# Altium project Business.PrjPcb
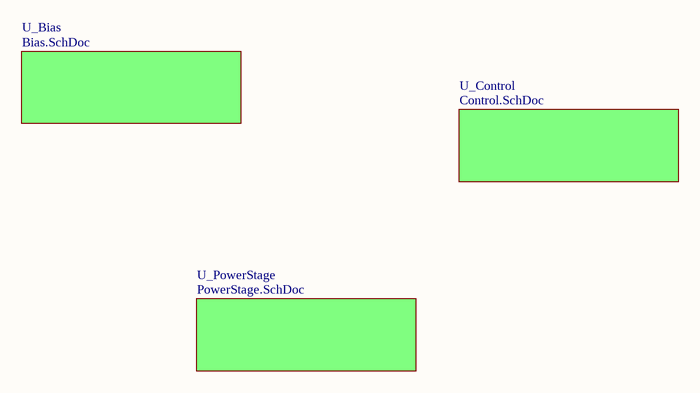
[diagram p0: Master.SchDoc]
3 sheets, 25 parts. Net scope: flat (ports and power ports of the same name join across sheets).
Board file: USB.PcbDoc
Sheets:
  Master.SchDoc
  MSC.SchDoc
  Lighting.SchDoc

## Sheet Master.SchDoc
size A; SheetNumber: 1; SheetTotal: 4

### Sub-sheets
U_Bias = Bias.SchDoc (file not in this document): no entries
U_Control = Control.SchDoc (file not in this document): no entries
U_PowerStage = PowerStage.SchDoc (file not in this document): no entries

## Sheet MSC.SchDoc: MSC
size A4; Revision: Rev A; SheetNumber: 2; SheetTotal: 3
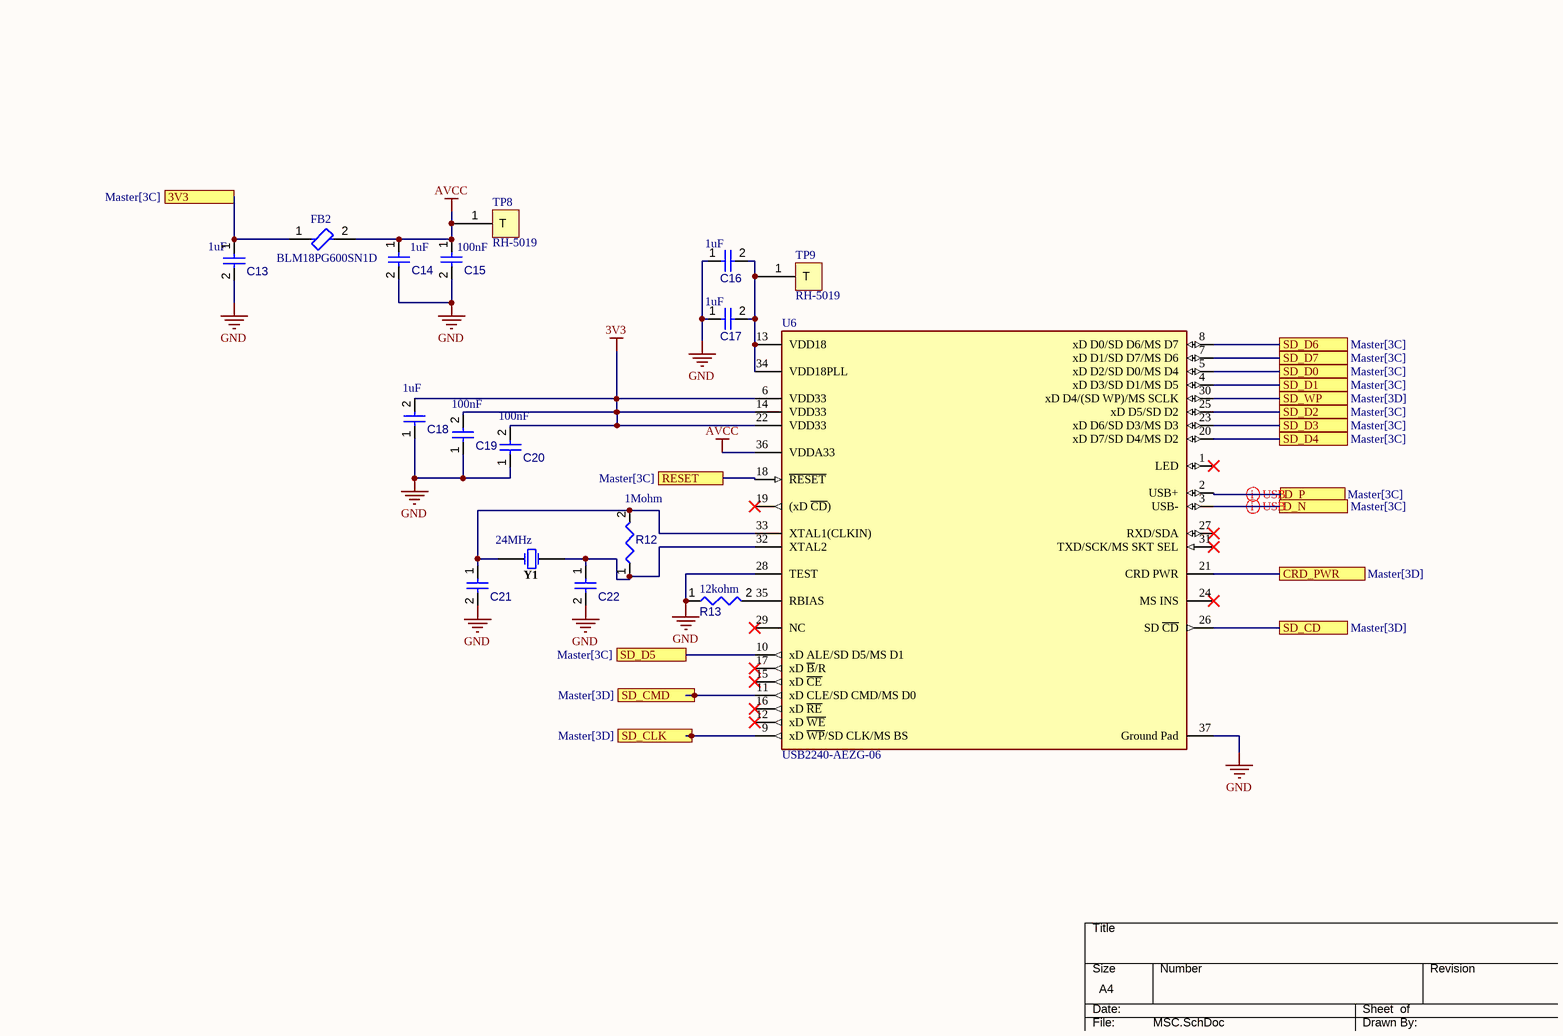
[diagram p1: MSC.SchDoc]

### Parts
C13  value 1uF  (hidden comment: Capacitors)
C14  value 1uF  (hidden comment: Capacitors,10uF)
C15  value 100nF  (hidden comment: Capacitors,100nF)
C16  value 1uF  (hidden comment: Capacitors,1uF)
C17  value 1uF  (hidden comment: Capacitors,1uF)
C18  value 1uF  (hidden comment: Capacitors,1uF)
C19  value 100nF  (hidden comment: Capacitors,0.1u)
C20  value 100nF  (hidden comment: Capacitors)
C21  Capacitors  (value not drawn)
C22  Capacitors  (value not drawn)
FB2  BLM18PG600SN1D  [FP-BLM18-0_15-t0_8-IPC_B]
R12  value 1Mohm  (hidden comment: Resistors)
R13  value 12kohm  (hidden comment: Resistors)
TP8  RH-5019  [RH-5019-Footprint-1]
TP9  RH-5019  [RH-5019-Footprint-1]
U6  USB2240-AEZG-06  [FP-36QFN-4106-6x6B-MFG]
Y1  Frequency: 24MHz  (hidden comment: Crystals & Oscillators,24MHz)

### Ports
3V3 (see Master[3C]), CRD_PWR (see Master[3D]), D_N (see Master[3C]), D_P (see Master[3C]), RESET (see Master[3C]), SD_CD (see Master[3D]), SD_CLK (see Master[3D]), SD_CMD (see Master[3D]), SD_D0 (see Master[3C]), SD_D1 (see Master[3C]), SD_D2 (see Master[3C]), SD_D3 (see Master[3C]), SD_D4 (see Master[3C]), SD_D5 (see Master[3C]), SD_D6 (see Master[3C]), SD_D7 (see Master[3C]), SD_WP (see Master[3D])

### Nets
3V3: C18.2 C19.2 C20.2 U6.6(VDD33) U6.14(VDD33) U6.22(VDD33)
AVCC: C14.1 C15.1 FB2.2 TP8.1(T) U6.36(VDDA33)
GND: C13.2 C14.2 C15.2 C16.1 C17.1 C18.1 C19.1 C20.1 C21.2 C22.2 R13.1 U6.28(TEST) U6.37(Ground_Pad)
NetC13_1: C13.1 FB2.1 ; port 3V3
NetC16_2: C16.2 C17.2 TP9.1(T) U6.13(VDD18) U6.34(VDD18PLL)
NetC21_1: C21.1 R12.2 U6.33(XTAL1(CLKIN)) Y1.2
NetC22_1: C22.1 R12.1 U6.32(XTAL2) Y1.1
NetR13_2: R13.2 U6.35(RBIAS)
NetU6_2: U6.2(USB+) ; port D_P
NetU6_3: U6.3(USB-) ; port D_N
NetU6_4: U6.4(xD_D3/SD_D1/MS_D5) ; port SD_D1
NetU6_5: U6.5(xD_D2/SD_D0/MS_D4) ; port SD_D0
NetU6_7: U6.7(xD_D1/SD_D7/MS_D6) ; port SD_D7
NetU6_8: U6.8(xD_D0/SD_D6/MS_D7) ; port SD_D6
NetU6_9: U6.9(xD_~{WP}/SD_CLK/MS_BS) ; port SD_CLK
NetU6_10: U6.10(xD_ALE/SD_D5/MS_D1) ; port SD_D5
NetU6_11: U6.11(xD_CLE/SD_CMD/MS_D0) ; port SD_CMD
NetU6_18: U6.18(~{RESET}) ; port RESET
NetU6_20: U6.20(xD_D7/SD_D4/MS_D2) ; port SD_D4
NetU6_21: U6.21(CRD_PWR) ; port CRD_PWR
NetU6_23: U6.23(xD_D6/SD_D3/MS_D3) ; port SD_D3
NetU6_25: U6.25(xD_D5/SD_D2) ; port SD_D2
NetU6_26: U6.26(SD_~{CD}) ; port SD_CD
NetU6_30: U6.30(xD_D4/(SD_WP)/MS_SCLK) ; port SD_WP

Not connected (* = marked no-connect by the designer): U6 1(LED)* 12(xD_~{WE})* 15(xD_~{CE})* 16(xD_~{RE})* 17(xD_~{B}/R)* 19((xD_~{CD}))* 24(MS_INS)* 27(RXD/SDA)* 29(NC)* 31(TXD/SCK/MS_SKT_SEL)*

### Layout directives
differential pair: NetU6_2, NetU6_3

### Notes on the sheet
- THIS DOCUMENT AND THE DATA DISCLOSED HEREIN OR
- HEREWITH IS THE PROPERTY OF ALTIUM LIMITED AND MAY
- DWG NO:
- REVISION
- REV:
- DESCRIPTION
- DATE
- APPROVED
- BE FREELY DISTRIBUTED IN WHOLE. NO RIGHTS ARE
- RESERVED OR EXPRESS OR IMPLIED WARANTEE GIVEN.
- ENG:
- APPROVALS
- PROJECT
- DSN:
- CHK:
- REFERENCE DOCUMENTS
- PROJECT REVISION:
- TITLE
- DOCUMENT REVISION:
- DESIGN ITEM:
- BOM:
- FAB DWG:
- PCB DWG:
- ASSY DWG:
- SCALE:
- A3
- SIZE
- CAGE CODE
- FILE NAME
- DWG NO.
- SHEET
- OF
- REV

### Library data of the parts
C13-C22 = Capacitors: Capacitor; Component Type: Capacitors
FB2 = CMP-0686-00575-3: Chip Ferrite Bead, 0603, 60Ω @ 100MHz, 0.1Ω, , 1A; ESR (Equivalent Series Resistance): 60R; Number of Lines: 1; Material: Steel; Tolerance: 25%; Shielding: Unshielded; Current Rating: 500mA; Resistance: 100mR; Package Quantity: 1; Termination: SMD/SMT; Lead Free: Lead Free; Max Operating Temperature: 125°C; Number of Circuits: 1; Length: 1.6mm; Min Operating Temperature: -55°C; Case Code (Metric): 1608; Max DC Current: 500mA; REACH SVHC: No SVHC; Frequency: 100MHz; Number of Pins: 2; RoHS Compliant: Yes; Height: 0.8mm; Depth: 0.8mm; Width: 0.8mm; Test Frequency: 100MHz; Case/Package: 0603; Impedance: 60R; Max Current Rating: 500mA; Packaging: Tape and Reel; DC Resistance (DCR): 100mR; Case Code (Imperial): 0603; Core Material: Ferrite
R12 R13 = Resistors: Resistor; Component Type: Resistors
TP8 TP9 = CMP-00030-00001-2: PC Test Point
U6 = CMP-06284-000093-1: IC INTERFACE SPECIALIZED 36QFN; Manufacturer: Murata; Manufacturer Part Number: GRM188R71H104KA93D; Operating Supply Current: 135mA; Max Supply Voltage: 3.6V; Data Rate: 35Mbps; Operating Supply Voltage: 3.3V; Number of Transceivers: 1; Min Supply Voltage: 3V; Interface: SPI; Dielectric Material: Ceramic; Value: 100nF; Multilayer: Yes; Tolerance  (fill in as +-): 10%; Rated DC Voltage (URdc): 50V; Temperature Characteristics Code: X7R; Length: 6.15mm; Width: 6.15mm; Lead Free: Lead Free; Number of Pins: 36; Series: -; Case/Package: QFN; RoHS Compliant: Yes; Packaging: Tray; Mount: Surface Mount; Package Quantity: 490; Min Operating Temperature: 0°C; Height: 0.95mm; Max Operating Temperature: 70°C; Reach SVHC Compliant: Yes; Supplier: Arrow Electronics; Supplier Part Number: GRM188R71H104KA93D; RoHS: Yes; Category: Ceramic Capacitors; Stock: 200000; Pricing: 8000=0.0106, 12000=0.0105, 20000=0.0104, 24000=0.0103, 100000=0.0096 (USD); Mounting Technology: Surface Mount; Pins: 2; Package Shape: Rectangular; Terminal Finish: Nickel; JESD-609 Code: e3; Capacitor Type: Ceramic; Package Style: SMTMeter; Tolerance (fill in as +-): 10%; Termination: Wraparound; ComponentLink1URL: https://datasheet.ciiva.com:443/pdfs/VipMasterIC/IC/MURE/MURE-S-A0004386736/MURE-S-A0004388063-1.pdf?src-supplier=IHS+Markit; ComponentLink1Description: https://datasheet.ciiva.com:443/pdfs/VipMasterIC/IC/MURE/MURE-S-A0004386736/MURE-S-A0004388063-1.pdf?src-supplier=IHS+Markit; ComponentLink2URL: https://datasheet.ciiva.com/11786/0900766b807a1cab-11786047.pdf?src-supplier=Rs; ComponentLink2Description: https://datasheet.ciiva.com/11786/0900766b807a1cab-11786047.pdf?src-supplier=Rs; ComponentLink3URL: https://datasheet.ciiva.com/19467/1857604-19467681.pdf?src-supplier=Jameco; ComponentLink3Description: https://datasheet.ciiva.com/19467/1857604-19467681.pdf?src-supplier=Jameco; ComponentLink4URL: https://datasheet.ciiva.com/29201/451744-da-01-en-vs-kondensator-0603-29201904.pdf?src-supplier=Conrad; ComponentLink4Description: https://datasheet.ciiva.com/29201/451744-da-01-en-vs-kondensator-0603-29201904.pdf?src-supplier=Conrad; ComponentLink5URL: https://datasheet.ciiva.com/131/partnumbering-e-01-131738.pdf?src-supplier=Digikey; ComponentLink5Description: https://datasheet.ciiva.com/131/partnumbering-e-01-131738.pdf?src-supplier=Digikey; ComponentLink6URL: https://datasheet.ciiva.com/131/partnumbering-e-01-131739.pdf?src-supplier=Digikey; ComponentLink6Description: https://datasheet.ciiva.com/131/partnumbering-e-01-131739.pdf?src-supplier=Digikey; ComponentLink7URL: https://datasheet.ciiva.com/131/partnumbering-e-01-131740.pdf?src-supplier=Digikey; ComponentLink7Description: https://datasheet.ciiva.com/131/partnumbering-e-01-131740.pdf?src-supplier=Digikey; ComponentLink8URL: https://datasheet.ciiva.com/14116/nmgrm-data-en-14116602.pdf?src-supplier=Distrelec; ComponentLink8Description: https://datasheet.ciiva.com/14116/nmgrm-data-en-14116602.pdf?src-supplier=Distrelec; ComponentLink9URL: https://datasheet.ciiva.com/48436/nmgrm-data-en-48436667.pdf?src-supplier=Distrelec; ComponentLink9Description: https://datasheet.ciiva.com/48436/nmgrm-data-en-48436667.pdf?src-supplier=Distrelec; ComponentLink10URL: https://datasheet.ciiva.com/28534/4360-28534245.pdf?src-supplier=Element14; ComponentLink10Description: https://datasheet.ciiva.com/28534/4360-28534245.pdf?src-supplier=Element14; ComponentLink11URL: https://datasheet.ciiva.com/7937/1747470-7937658.pdf?src-supplier=Element14; ComponentLink11Description: https://datasheet.ciiva.com/7937/1747470-7937658.pdf?src-supplier=Element14; ComponentLink12URL: https://datasheet.ciiva.com/7937/4360-7937659.pdf?src-supplier=Element14; ComponentLink12Description: https://datasheet.ciiva.com/7937/4360-7937659.pdf?src-supplier=Element14; ComponentLink13URL: https://datasheet.ciiva.com:443/pdfs/VipMasterIC/IC/KEME/KEME-S-A0008991665/KEME-S-A0008991665-1.pdf?src-supplier=IHS+Markit; ComponentLink13Description: https://datasheet.ciiva.com:443/pdfs/VipMasterIC/IC/KEME/KEME-S-A0008991665/KEME-S-A0008991665-1.pdf?src-supplier=IHS+Markit
Y1 = Crystals & Oscillators: Crystal; Component Type: Crystals & Oscillators

## Sheet Lighting.SchDoc
size A; SheetNumber: 3; SheetTotal: 3
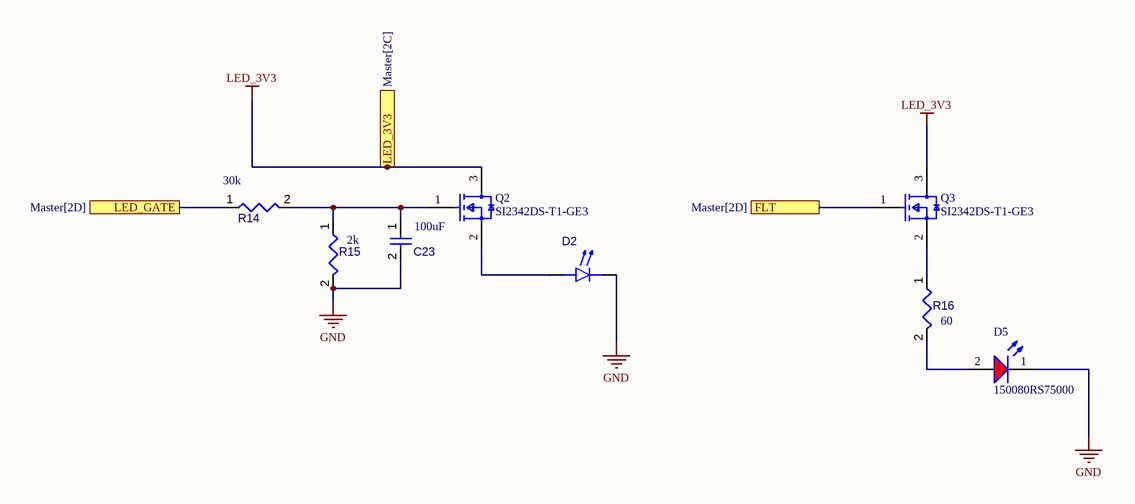
[diagram p2: Lighting.SchDoc]

### Parts
C23  value 100uF  (hidden comment: Capacitors,100uF)
D2  HL-AM-2835H489W-S1-08HL-HR3  [HL-AM-2835H489W-S1-08HL-HR3-Footprint-1]  (value not drawn)
D5  150080RS75000  [WL-SMCW_0805_150080xx75000]
Q2  SI2342DS-T1-GE3  [FP-S-03946-MFG]
Q3  SI2342DS-T1-GE3  [FP-S-03946-MFG]
R14  value 30k  (hidden comment: Resistors,30k)
R15  value 2k  (hidden comment: Resistors,2k)
R16  value 60  (hidden comment: Resistors,60)

### Ports
FLT (see Master[2D]), LED_3V3 (see Master[2C]), LED_GATE (see Master[2D])

### Nets
GND: C23.2 D2.1(K) D5.1(K) R15.2
LED_3V3: Q2.3(D) Q3.3(D) ; port LED_3V3
NetC23_1: C23.1 Q2.1(G) R14.2 R15.1
NetD2_2: D2.2(A) Q2.2(S)
NetD5_2: D5.2(A) R16.2
NetQ3_1: Q3.1(G) ; port FLT
NetQ3_2: Q3.2(S) R16.1
NetR14_1: R14.1 ; port LED_GATE

### Library data of the parts
C23 = Capacitors: Capacitor; Component Type: Capacitors
D2 = CMP-007-00036-1
D5 = CMP-1426-00011-3: LED Uni-Color Red 630nm 2-Pin Chip 0805(2012Metric) T/R; Viewing Angle: 140°; Max Junction Temperature (Tj): 95°C; Power Dissipation: 72mW; Forward Current: 100mA; Forward Voltage: 2V; Wavelength: 625nm; Test Current: 20mA; Max Reverse Voltage (DC): 5V; Luminous Intensity: 150mcd; Lens Style: Clear, Rectangular; REACH SVHC: Unknown; Height: 700µm; Case Code (Metric): 2012; Peak Wavelength: 630nm; Length: 2mm; Width: 1.25mm; RoHS: Compliant; Packaging: Tape and Reel; Dominant Wavelength: 625nm; Color: Red; Case Code (Imperial): 0805; Min Operating Temperature: -40°C; Mount: Surface Mount; Max Operating Temperature: 85°C; Case/Package: 0805
Q2 Q3 = CMP-02550-000018-1: MOSFET N-CH 8V 6A SOT-23; Manufacturer: Vishay; Number Of N Channels: 1; Pulse Drain Current: 30A; Reverse Recovery Charge: 17nC; Depletion Mode: False; Reverse Recovery Time: 40ns; Max Junction Temp: +150°C; Power Dissipation: 1.3W; Transconductance: 75S; Threshold Vgs Min: 0.35V; Turn Off Delay Time: 65ns; Rthja Max: 75°C/W; Input Capacitace At Vds: 1070pF @ 4V; Gate Charge At Vgs: 10.5nC @ 4.5V; Gate To Source Voltage: 5V; Turn On Delay Time: 6ns; Drain To Source Resistance: 0.014Ω; Typ Forward Diode Voltage: 0.82V; Standoff Height: 0.01mm; Max Forward Diode Voltage: 1.2V; Threshold Vgs Max: 0.8V; Continuous Drain Current: 6A; Device Class L1: Discrete Semiconductors; Mouser Description: MOSFET 8V 6A 2.5; Category: Trans; Digikey Description: MOSFET N-CH 8V 6A SOT-23; Manufacturer Part Number: SI2342DS-T1-GE3; Device Class L2: Transistors; Octopart: https://octopart.com/si2342ds-t1-ge3-vishay-45050957; ComponentLink2URL: https://www.vishay.com/docs/63302/si2342ds.pdf; RoHS: TRUE; Drain To Source Breakdown Voltage: 8V; Height: 1.12mm; Lead Free: Yes; Temperature Range Low: -55°C; Package: S-03946; Device Class L3: MOSFETs; Temperature Range High: +150°C; Ipc Land Pattern Name: SOT95P237X100-3; Drain To Source Voltage: 8V; Temperature: -55°C to +150°C; ComponentLink2Description: Datasheet; Number Of Channels: 1; Automotive: No
R14-R16 = Resistors: Resistor; Component Type: Resistors

## Nets that join several sheets
GND: MSC (13 pins), Lighting (C23.2 D2.1 D5.1 R15.2)